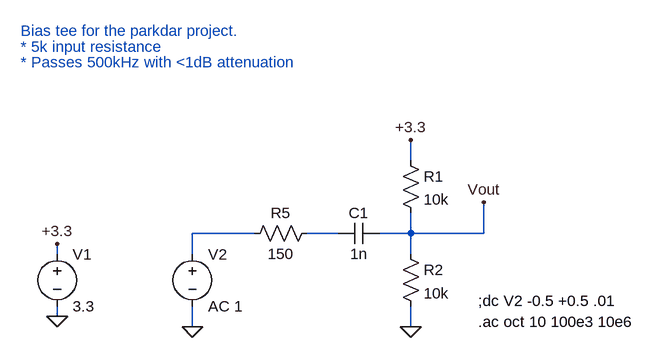
[diagram p0: schematic bias_tee.asc]
bias_tee.asc, the LTspice schematic file:
Version 4
SHEET 1 880 680
WIRE 368 -48 368 -80
WIRE 128 64 32 64
WIRE 256 64 208 64
WIRE 368 64 368 32
WIRE 368 64 320 64
WIRE 480 64 480 16
WIRE 480 64 368 64
WIRE -176 96 -176 80
WIRE 32 96 32 64
WIRE 368 96 368 64
WIRE -176 192 -176 176
WIRE 32 208 32 176
WIRE 368 208 368 176
FLAG -176 192 0
FLAG -176 80 +3.3
FLAG 32 208 0
FLAG 480 16 Vout
FLAG 368 208 0
FLAG 368 -80 +3.3
SYMBOL voltage -176 80 R0
WINDOW 123 0 0 Left 0
WINDOW 39 0 0 Left 0
SYMATTR InstName V1
SYMATTR Value 3.3
SYMBOL res 352 -64 R0
SYMATTR InstName R1
SYMATTR Value 10k
SYMBOL res 352 80 R0
SYMATTR InstName R2
SYMATTR Value 10k
SYMBOL cap 256 80 R270
WINDOW 0 32 32 VTop 0
WINDOW 3 0 32 VBottom 0
SYMATTR InstName C1
SYMATTR Value 1n
SYMBOL res 112 80 R270
WINDOW 0 32 56 VTop 0
WINDOW 3 0 56 VBottom 0
SYMATTR InstName R5
SYMATTR Value 150
SYMBOL voltage 32 80 R0
WINDOW 123 0 0 Left 0
WINDOW 39 0 0 Left 0
SYMATTR InstName V2
SYMATTR Value AC 1
TEXT 472 168 Left 0 !;dc V2 -0.5 +0.5 .01
TEXT -232 -248 Left 0 ;Bias tee for the parkdar project.
TEXT -232 -224 Left 0 ;* 5k input resistance
TEXT -232 -200 Left 0 ;* Passes 500kHz with <1dB attenuation
TEXT 472 200 Left 0 !.ac oct 10 100e3 10e6

The netlist it stands for:
* bias_tee.asc
V1 +3.3 0 3.3
R1 +3.3 Vout 10k
R2 Vout 0 10k
C1 N002 Vout 1n
R5 N001 N002 150
V2 N001 0 AC 1
;dc V2 -0.5 +0.5 .01
* Bias tee for the parkdar project.
* * 5k input resistance
* * Passes 500kHz with <1dB attenuation
.ac oct 10 100e3 10e6
.backanno
.end